# EAGLE design MSP_Mini_Voyger_V5 (EAGLE 7.3.0)
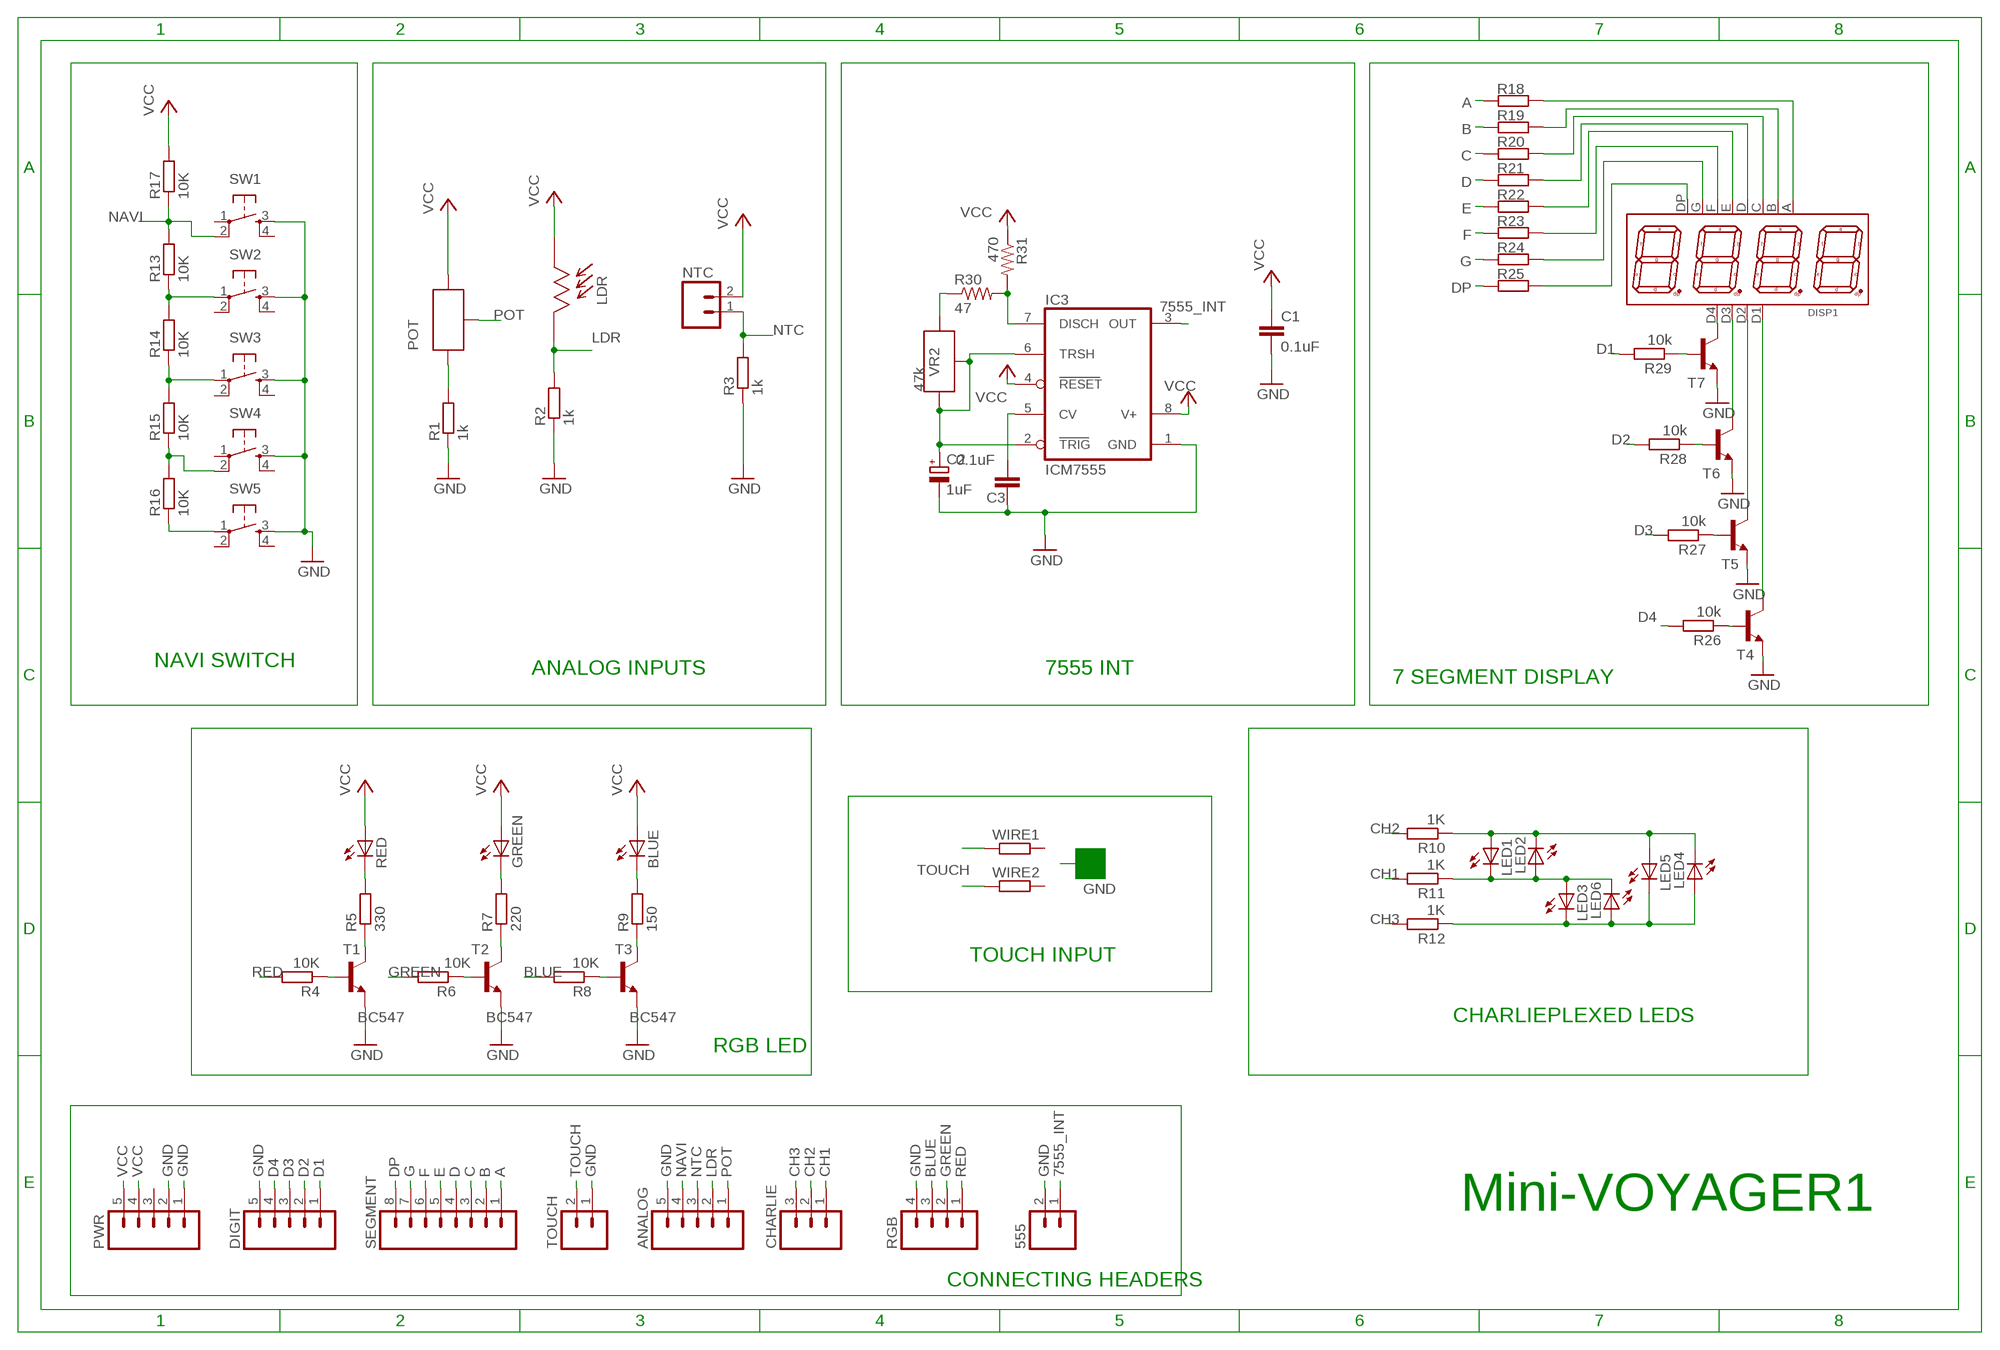
[diagram p0: schematic, sheet 1]

## Parts
555  M02  [02P]
ANALOG  M05  [05P]
BLUE  LED5MM  [LED5MM]
C1  0.1uF  C-EU050-024X044  [C050-024X044]
C2  1uF  CPOL-EUE2.5-7  [E2,5-7]
C3  0.1uF  C-EU025-024X044  [C025-024X044]
CHARLIE  M03  [03P]
DIGIT  M05  [05P]
DISP1  7-SEG_4D_0.36  [7SEG-4DIG]
GREEN  LED5MM  [LED5MM]
IC3  ICM7555  [DIL08]
LDR  CDSLDR3MM  [LDR3MM]
LED1  LED3MM  [LED3MM]
LED2  LED3MM  [LED3MM]
LED3  LED3MM  [LED3MM]
LED4  LED3MM  [LED3MM]
LED5  LED3MM  [LED3MM]
LED6  LED3MM  [LED3MM]
NTC  M02  [02P]
POT  POTNORMAL  [RJ9W]
PWR  M05  [05P]
R1  1k  R-EU_0207/10  [0207/10]
R2  1k  R-EU_0207/10  [0207/10]
R3  1k  R-EU_0207/10  [0207/10]
R4  10K  R-EU_0207/7  [0207/7]
R5  330  R-EU_0207/7  [0207/7]
R6  10K  R-EU_0207/7  [0207/7]
R7  220  R-EU_0207/7  [0207/7]
R8  10K  R-EU_0207/7  [0207/7]
R9  150  R-EU_0207/7  [0207/7]
R10  1K  R-EU_0207/10  [0207/10]
R11  1K  R-EU_0207/10  [0207/10]
R12  1K  R-EU_0207/10  [0207/10]
R13  10K  R-EU_0207/10  [0207/10]
R14  10K  R-EU_0207/10  [0207/10]
R15  10K  R-EU_0207/10  [0207/10]
R16  10K  R-EU_0207/10  [0207/10]
R17  10K  R-EU_0207/10  [0207/10]
R18  1k  R-EU_0207/7  [0207/7]
R19  1k  R-EU_0207/7  [0207/7]
R20  1k  R-EU_0207/7  [0207/7]
R21  1k  R-EU_0207/7  [0207/7]
R22  1k  R-EU_0207/7  [0207/7]
R23  1k  R-EU_0207/7  [0207/7]
R24  1k  R-EU_0207/7  [0207/7]
R25  1k  R-EU_0207/7  [0207/7]
R26  10k  R-EU_0207/7  [0207/7]
R27  10k  R-EU_0207/7  [0207/7]
R28  10k  R-EU_0207/7  [0207/7]
R29  10k  R-EU_0207/7  [0207/7]
R30  47  R-US_0207/7  [0207/7]
R31  470  R-US_0207/7  [0207/7]
RED  LED5MM  [LED5MM]
RGB  M04  [04P]
SEGMENT  M08  [08P]
SW1  OMRON_SWITCH_10-XX  [B3F-10XX]
SW2  OMRON_SWITCH_10-XX  [B3F-10XX]
SW3  OMRON_SWITCH_10-XX  [B3F-10XX]
SW4  OMRON_SWITCH_10-XX  [B3F-10XX]
SW5  OMRON_SWITCH_10-XX  [B3F-10XX]
T1  BC547  [TO92]
T2  BC547  [TO92]
T3  BC547  [TO92]
T4  BC547  [TO92]
T5  BC547  [TO92]
T6  BC547  [TO92]
T7  BC547  [TO92]
TOUCH  M02  [02P]
VR2  47k  POTNORMAL  [RJ9W]
WIRE1  R-EU_0207/15  [0207/15]
WIRE2  R-EU_0207/15  [0207/15]

## Nets
7555_INT: 555.1 IC3.3(OUT)
A: R18.2 SEGMENT.1
B: R19.2 SEGMENT.2
BLUE: R8.2 RGB.3
C: R20.2 SEGMENT.3
CH1: CHARLIE.1 R11.2
CH2: CHARLIE.2 R10.2
CH3: CHARLIE.3 R12.2
D: R21.2 SEGMENT.4
D1: DIGIT.1 R29.2
D2: DIGIT.2 R28.2
D3: DIGIT.3 R27.2
D4: DIGIT.4 R26.2
DP: R25.2 SEGMENT.8
E: R22.2 SEGMENT.5
F: R23.2 SEGMENT.6
G: R24.2 SEGMENT.7
GND: 555.2 ANALOG.5 C1.2 C2.- C3.2 DIGIT.5 IC3.1(GND) PWR.1 PWR.2 R1.1 R2.1 R3.1 RGB.4 SW1.3(S) SW2.3(S) SW3.3(S) SW4.3(S) SW5.3(S) T1.1(E) T2.1(E) T3.1(E) T4.1(E) T5.1(E) T6.1(E) T7.1(E) TOUCH.1
GREEN: R6.2 RGB.2
LDR: ANALOG.2 LDR.P$2 R2.2
N$1: POT.E R1.2
N$2: LED1.A LED2.K(C) LED4.K(C) LED5.A R10.1
N$3: IC3.7(DISCH) R30.2 R31.2
N$8: R5.1 T1.3(C)
N$10: DISP1.D1 T4.3(C)
N$11: DISP1.D4 T7.3(C)
N$12: DISP1.A R18.1
N$13: DISP1.B R19.1
N$14: R4.1 T1.2(B)
N$15: R13.1 R14.2 SW2.1(P)
N$16: R14.1 R15.2 SW3.1(P)
N$17: R15.1 R16.2 SW4.2(P1)
N$18: R16.1 SW5.1(P)
N$19: R6.1 T2.2(B)
N$20: DISP1.C R20.1
N$21: DISP1.D R21.1
N$23: R5.2 RED.K(C)
N$24: GREEN.K(C) R7.2
N$25: DISP1.E R22.1
N$26: R8.1 T3.2(B)
N$27: R9.1 T3.3(C)
N$28: BLUE.K(C) R9.2
N$30: R26.1 T4.2(B)
N$31: R27.1 T5.2(B)
N$32: R28.1 T6.2(B)
N$33: R29.1 T7.2(B)
N$34: DISP1.D2 T5.3(C)
N$35: DISP1.D3 T6.3(C)
N$36: DISP1.F R23.1
N$37: DISP1.G R24.1
N$38: DISP1.DP R25.1
N$44: C2.+ IC3.2(TRIG) IC3.6(TRSH) VR2.E VR2.S
N$51: R30.1 VR2.A
N$52: C3.1 IC3.5(CV)
N$323: LED3.K(C) LED4.A LED5.K(C) LED6.A R12.1
N$342: LED1.K(C) LED2.A LED3.A LED6.K(C) R11.1
NAVI: ANALOG.4 R13.2 R17.1 SW1.2(P1)
NTC: ANALOG.3 NTC.1 R3.2
POT: ANALOG.1 POT.S
R7: R7.1 T2.3(C)
RED: R4.2 RGB.1
TOUCH: TOUCH.2 WIRE1.1 WIRE2.1
VCC: BLUE.A C1.1 GREEN.A IC3.4(RESET) IC3.8(V+) LDR.P$1 NTC.2 POT.A PWR.4 PWR.5 R17.2 R31.1 RED.A
Unconnected: PWR.3 SW1.1(P) SW1.4(S1) SW2.2(P1) SW2.4(S1) SW3.2(P1) SW3.4(S1) SW4.1(P) SW4.4(S1) SW5.2(P1) SW5.4(S1) WIRE1.2 WIRE2.2

## Notes on the sheet
- NAVI SWITCH
- ANALOG INPUTS | 7555 INT
- 7 SEGMENT DISPLAY
- TOUCH INPUT
- CHARLIEPLEXED LEDS
- RGB LED
- Mini-VOYAGER1
- CONNECTING HEADERS

## Library data of the parts
555 = con-amp-quick:M02: AMP QUICK CONNECTOR; OC_FARNELL: unknown; OC_NEWARK: unknown
ANALOG DIGIT PWR = con-amp-quick:M05: AMP QUICK CONNECTOR; OC_FARNELL: unknown; OC_NEWARK: unknown
BLUE GREEN RED = CEDT_JANUARY_2015_v5:LED
C1 C3 = rcl:C-EU: CAPACITOR, European symbol
C2 = rcl:CPOL-EU: POLARIZED CAPACITOR, European symbol
CHARLIE = con-amp-quick:M03: AMP QUICK CONNECTOR; OC_FARNELL: unknown; OC_NEWARK: unknown
DISP1 = 7-seg_disp_0.36in:7-SEG_4D_0.36: 7-Segment 4-Digit Display 0.36" (9.11mm) Common Cathode. Created by David J. LEWIS (2015)
IC3 = maxim:ICM7555: TIMER; MF: MAXIM; MPN: ICM7555IPA+; OC_FARNELL: 9663762; OC_NEWARK: 68K4387
LDR = CEDT_JANUARY_2015_v7:CDSLDR3MM
LED1-LED6 = CEDT_JANUARY_2015_v7:LED
NTC TOUCH = CEDT_JANUARY_2015_v5:M02: AMP QUICK CONNECTOR
POT = CEDT_JANUARY_2015_v7:POT
R1-R29 WIRE1 WIRE2 = rcl:R-EU_: RESISTOR, European symbol
R30 R31 = rcl:R-US_: RESISTOR, American symbol
RGB = con-amp-quick:M04: AMP QUICK CONNECTOR; OC_FARNELL: unknown; OC_NEWARK: unknown
SEGMENT = con-amp-quick:M08: AMP QUICK CONNECTOR; OC_FARNELL: unknown; OC_NEWARK: unknown
SW1-SW5 = CEDT_JANUARY_2015_v7:OMRON_SWITCH
T1-T7 = transistor:BC547: NPN TRANSISTOR
VR2 = CEDT_JANUARY_2015_v4:POT

## Board
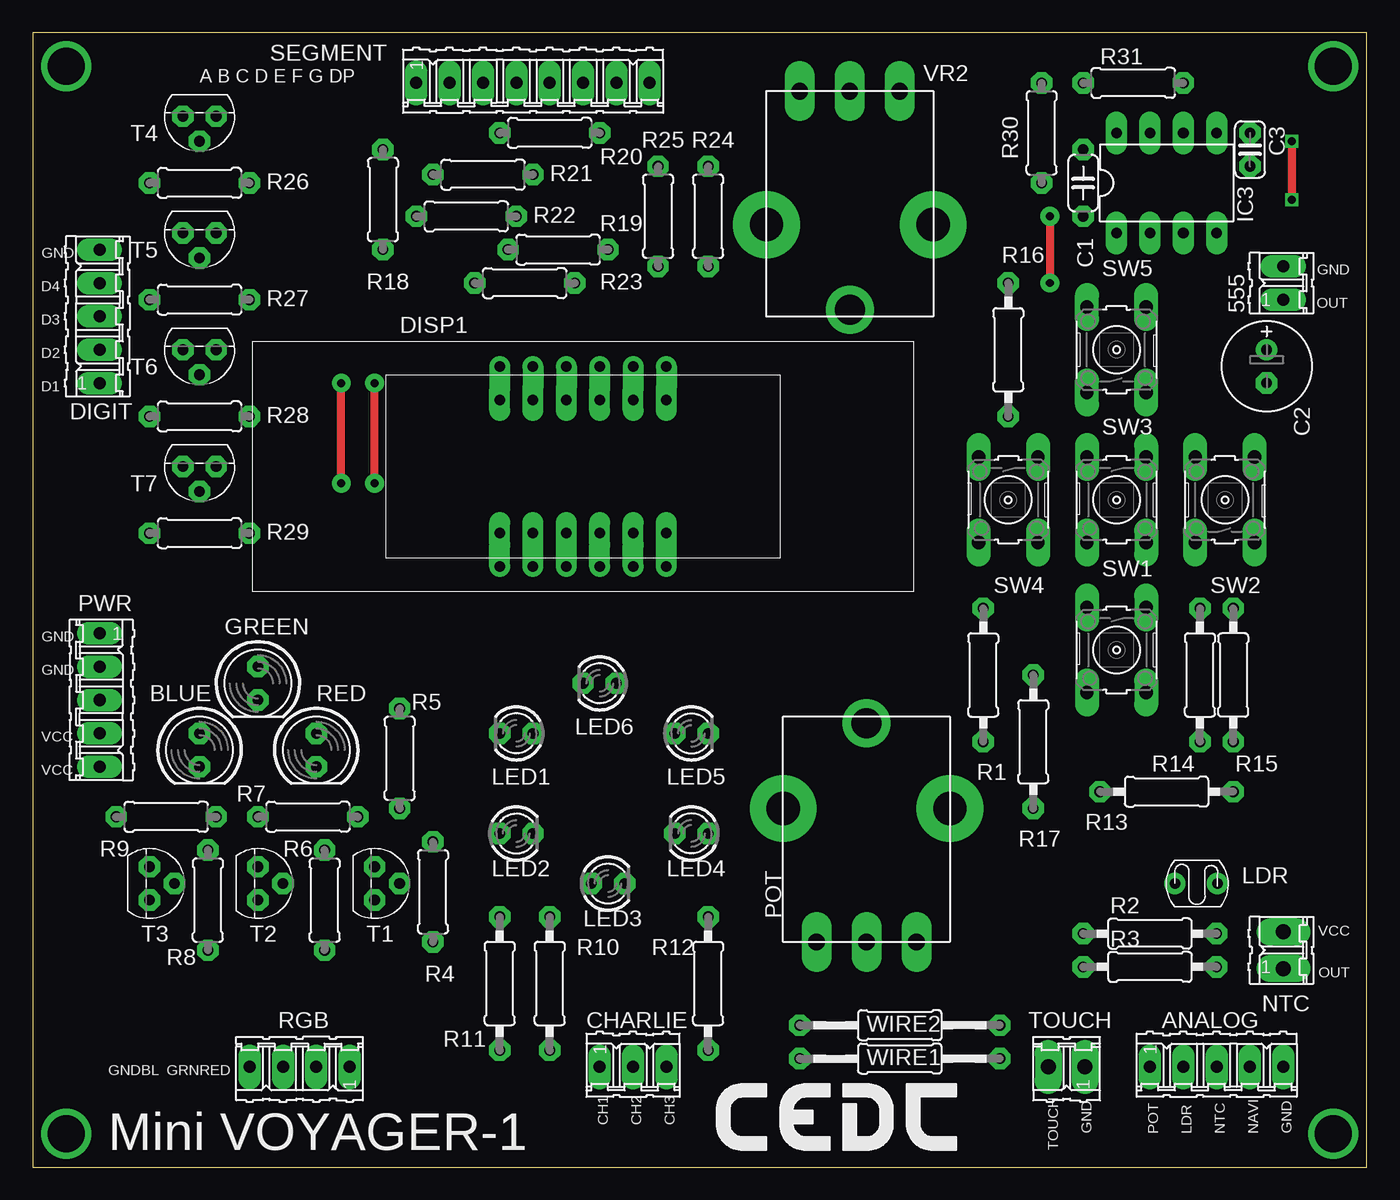
[diagram p1: board, top side]
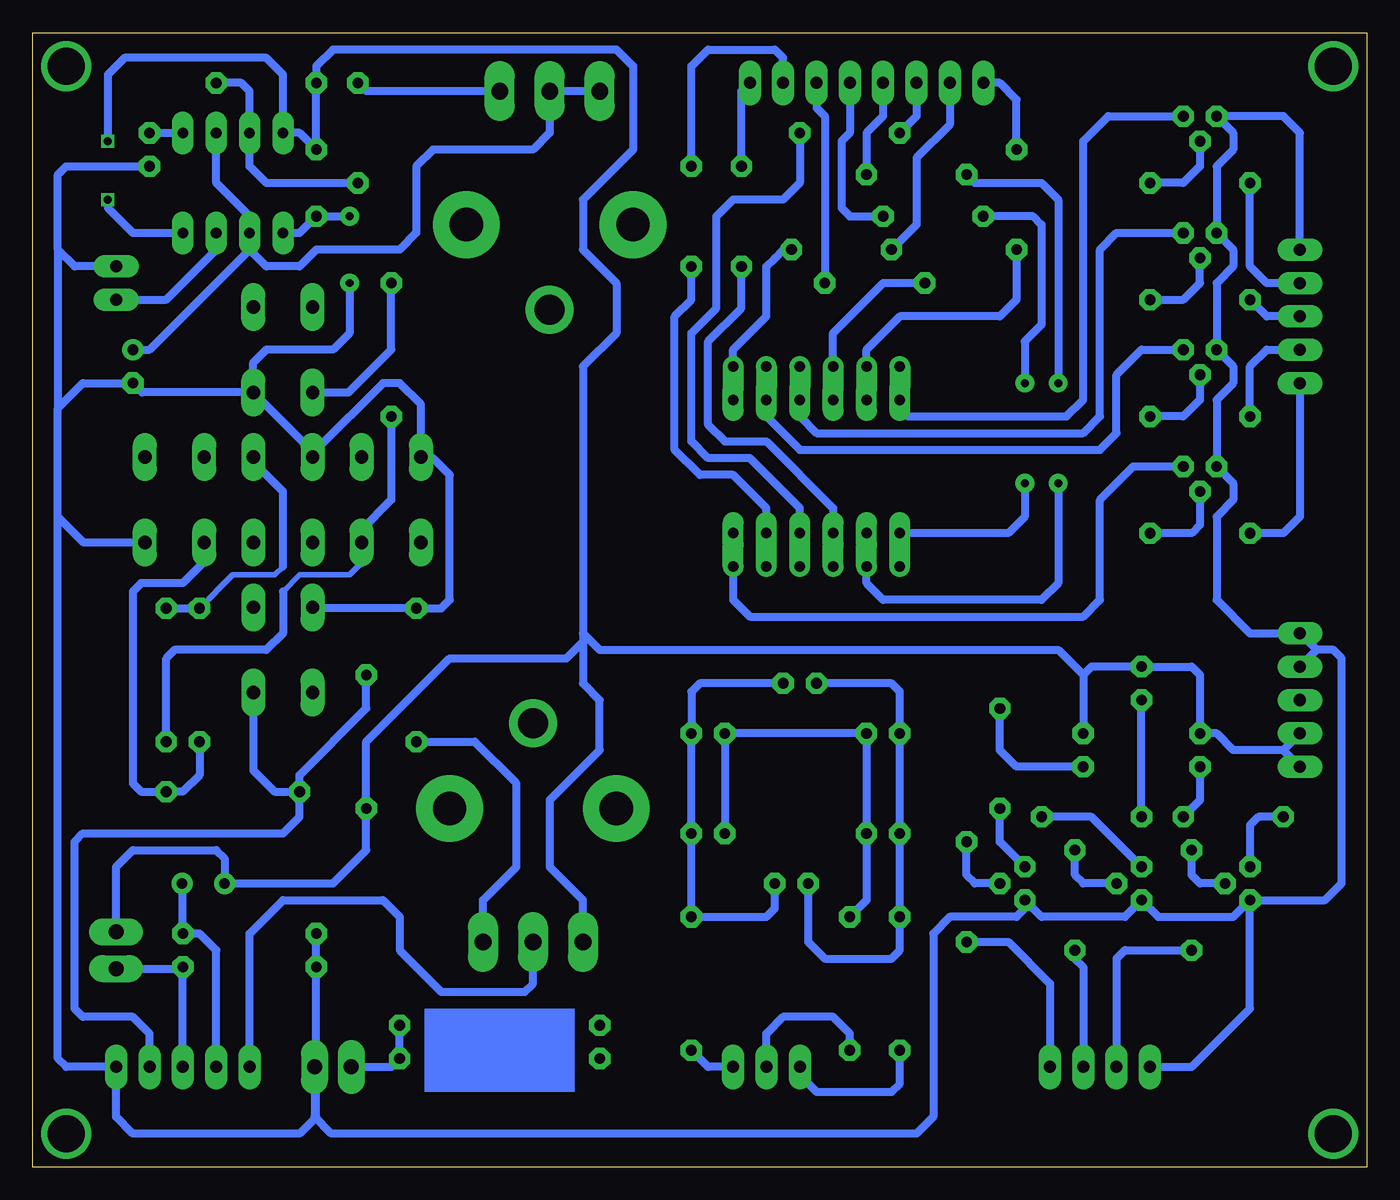
[diagram p2: board, bottom side, seen from below]

Size 101.6 x 86.36 mm. Coordinates in mm from the lower left corner, seen from the top.
Outline: 0,0 101.6,0 101.6,86.36 0,86.36 0,0
Copper layers (1*16): Top 0.035mm / dielectric 1.5mm / Bottom 0.035mm
Design rules "default *": minimum track width 16mil, minimum drill 24mil, track to track 16mil, track to pad 16mil, pad to pad 16mil, via to via 16mil, smd to smd 8mil, copper to edge 40mil, drill to drill 8mil, minimum pad ring 16mil, minimum via ring 8mil, stop-mask expansion 4mil, vias tented up to drill 0mil, thermal gap 10mil

### Footprints (pad centres in the part's own frame; a part is rotated, then mirrored left to right if it is on the bottom)
02P = drill 0.914 long: 1 -1.27,0; 2 1.27,0
05P = drill 0.914 long: 1 -5.08,0; 2 -2.54,0; 3 0,0; 4 2.54,0; 5 5.08,0
LED5MM = drill 0.813 octagon: A -1.27,0; K 1.27,0
C050-024X044 = drill 0.813 octagon: 1 -2.54,0; 2 2.54,0
E2,5-7 = drill 0.813 pad 1.6: + -1.27,0 | drill 0.813 pad 1.6 octagon: - 1.27,0
C025-024X044 = drill 0.813 octagon: 1 -1.27,0; 2 1.27,0
03P = drill 0.914 long: 1 -2.54,0; 2 0,0; 3 2.54,0
7SEG-4DIG = drill 0.8 long: A -3.81,5.08; B 6.35,5.08; C 1.27,-5.08; D -3.81,-5.08; D1 -6.35,5.08; D2 1.27,5.08; D3 3.81,5.08; D4 6.35,-5.08; DP -1.27,-5.08; E -6.35,-5.08; F -1.27,5.08; G 3.81,-5.08 | drill 0.8 offset: P$1 6.35,7.62; P$2 3.81,7.62; P$3 1.27,7.62; P$4 -1.27,7.62; P$5 -3.81,7.62; P$6 -6.35,7.62; P$7 -6.35,-7.62; P$8 -3.81,-7.62; P$9 -1.27,-7.62; P$10 1.27,-7.62; P$11 3.81,-7.62; P$12 6.35,-7.62
DIL08 = drill 0.813 long: 1 -3.81,-3.81; 2 -1.27,-3.81; 3 1.27,-3.81; 4 3.81,-3.81; 5 3.81,3.81; 6 1.27,3.81; 7 -1.27,3.81; 8 -3.81,3.81
LDR3MM = drill 0.8: P$1 0,0; P$2 3.24,0
LED3MM = drill 0.813 octagon: A -1.27,0; K 1.27,0
02P' = drill 1.143 long: 1 -1.397,0; 2 1.397,0
RJ9W = drill 1.27 long: A 3.81,8.255; E -3.81,8.255; S 0,8.255 | drill 2.286 pad 3.658: P$1 0,-8.382 | drill 2.54 pad 5.08: P$3 6.35,-1.905; P$4 -6.35,-1.905
0207/10 = drill 0.813 octagon: 1 -5.08,0; 2 5.08,0
0207/7 = drill 0.813 octagon: 1 -3.81,0; 2 3.81,0
04P = drill 0.914 long: 1 -3.81,0; 2 -1.27,0; 3 1.27,0; 4 3.81,0
08P = drill 0.914 long: 1 -8.89,0; 2 -6.35,0; 3 -3.81,0; 4 -1.27,0; 5 1.27,0; 6 3.81,0; 7 6.35,0; 8 8.89,0
B3F-10XX = drill 1.016 long: 1 -3.251,2.261; 2 3.251,2.261; 3 -3.251,-2.261; 4 3.251,-2.261
TO92 = drill 0.813 octagon: 1 1.27,0; 2 0,1.905; 3 -1.27,0
0207/15 = drill 0.813 octagon: 1 -7.62,0; 2 7.62,0

### Placement (x,y rotation side)
555  95.25,67.31 90 top
ANALOG  90.17,7.62 0 top
BLUE  12.7,31.75 270 top
C1  80.01,74.93 270 top
C2  93.98,60.96 270 top
C3  92.71,77.47 270 top
CHARLIE  45.72,7.62 0 top
DIGIT  5.08,64.77 90 top
DISP1  41.91,53.34 0 top
GREEN  17.14,36.83 270 top
IC3  86.36,74.93 0 top
LDR  87,21.59 0 top
LED1  36.83,33.02 180 top
LED2  36.83,25.4 0 top
LED3  43.81,21.59 0 top
LED4  50.16,25.4 180 top
LED5  50.16,33.02 0 top
LED6  43.18,36.83 180 top
NTC  [02P']  95.25,16.51 90 top
POT  63.5,25.4 180 top
PWR  5.08,35.56 270 top
R1  72.39,37.47 270 top
R2  85.09,17.78 0 top
R3  85.09,15.24 0 top
R4  30.48,20.95 270 top
R5  27.94,31.11 90 top
R6  22.23,20.32 270 top
R7  20.95,26.67 180 top
R8  13.34,20.32 270 top
R9  10.16,26.67 0 top
R10  39.37,13.97 270 top
R11  35.56,13.97 270 top
R12  51.44,13.97 270 top
R13  86.36,28.57 180 top
R14  88.9,37.47 270 top
R15  91.44,37.47 90 top
R16  74.3,62.23 270 top
R17  76.2,32.38 270 top
R18  26.67,73.66 90 top
R19  40.01,69.85 180 top
R20  39.37,78.74 180 top
R21  34.29,75.56 0 top
R22  33.02,72.39 0 top
R23  37.47,67.31 0 top
R24  51.44,72.39 90 top
R25  47.62,72.39 90 top
R26  12.7,74.93 180 top
R27  12.7,66.04 180 top
R28  12.7,57.15 180 top
R29  12.7,48.26 180 top
R30  76.83,78.74 270 top
R31  83.82,82.55 0 top
RED  21.59,31.75 270 top
RGB  20.32,7.62 180 top
SEGMENT  38.1,82.55 0 top
SW1  82.55,39.37 270 top
SW2  90.81,50.8 90 top
SW3  82.55,50.8 270 top
SW4  74.3,50.8 270 top
SW5  82.55,62.23 90 top
T1  26.04,21.59 270 top
T2  17.14,21.59 270 top
T3  8.89,21.59 270 top
T4  12.7,80.01 180 top
T5  12.7,71.12 180 top
T6  12.7,62.23 180 top
T7  12.7,53.34 180 top
TOUCH  [02P']  78.74,7.62 180 top
U$1  [LOGO-CEDT-SILK-18MM]  52.07,1.27 0 top
VR2  62.23,73.66 0 top
WIRE1  66.04,8.26 180 top
WIRE2  66.04,10.79 180 top

### Tracks (layer width: path | path; a pad name or v marks a point on that pad's centre or on a via)
7555_INT
  Bottom 0.61: IC3.3 87.63,69.85 91.44,66.04 555.1
A
  Bottom 0.61: R18.2 26.67,81.28 27.94,82.55 SEGMENT.1
B
  Bottom 0.61: SEGMENT.2 31.75,79.38 34.29,76.83 34.29,71.75 R19.2
BLUE
  Bottom 0.61: R8.2 18.41,16.51 19.05,15.88 RGB.3
C
  Bottom 0.61: SEGMENT.3 34.29,80.01 R20.2
CH1
  Bottom 0.61: R11.2 35.56,6.35 36.2,5.71 41.91,5.71 43.18,6.99 CHARLIE.1
CH2
  Bottom 0.61: CHARLIE.2 45.72,10.16 44.45,11.43 40.64,11.43 39.37,10.16 R10.2
CH3
  Bottom 0.61: R12.2 50.16,7.62 CHARLIE.3
D
  Bottom 0.61: SEGMENT.4 36.83,80.01 38.1,78.74 R21.2
D1
  Bottom 0.61: DIGIT.1 5.08,49.53 6.35,48.26 R29.2
D2
  Bottom 0.61: R28.2 8.89,60.96 7.62,62.23 DIGIT.2
D3
  Bottom 0.61: DIGIT.3 7.62,64.77 R27.2
D4
  Bottom 0.61: DIGIT.4 7.62,67.31 8.89,68.58 R26.2
DP
  Bottom 0.61: R25.2 47.62,81.92 SEGMENT.8
E
  Bottom 0.61: SEGMENT.5 39.37,78.74 40.01,78.11 40.01,73.03 39.37,72.39 R22.2
F
  Bottom 0.61: SEGMENT.6 41.91,80.64 41.27,80.01 R23.2
G
  Bottom 0.61: SEGMENT.7 44.45,84.45 45.09,85.09 50.16,85.09 51.44,83.82 R24.2
GND  (via drill 0.6 pad 1.42)
  Top 0.61: v77.47,72.39 v77.47,67.31
  Bottom 0.61: T3.1 10.16,19.05 15.88,19.05 T2.1 18.41,19.05 24.77,19.05 T1.1 26.04,19.68 26.67,19.05 31.75,19.05 33.02,17.78 33.02,3.81 34.29,2.54 78.87,2.54 80.14,3.81 | T3.1 8.89,12.06 13.34,7.62 RGB.4 | T3.1 3.17,20.32 1.91,21.59 1.91,38.73 2.54,39.37 3.81,39.37 | 3.81,39.37 PWR.1 8.89,40.64 11.43,43.18 11.43,49.53 10.16,50.8 10.16,52.07 T7.1 11.43,58.42 10.16,59.69 10.16,60.96 T6.1 11.43,67.31 10.16,68.58 10.16,69.85 T5.1 11.43,76.2 10.16,77.47 10.16,78.74 T4.1 6.35,80.01 5.08,78.74 DIGIT.5 | PWR.2 3.81,39.37 | 80.14,3.81 80.14,3.68 | 80.14,3.68 81.28,2.54 93.98,2.54 95.25,3.81 ANALOG.5 99.06,7.62 99.69,8.26 99.69,49.53 | SW1.3 79.73,42.55 R1.1 70.48,42.55 69.85,43.18 69.85,52.7 71.12,53.98 71.96,53.98 SW4.3 72.03,58.06 73.66,59.69 74.93,59.69 80.01,54.61 | TOUCH.1 80.14,3.81 | 80.14,3.68 80.01,3.81 R3.1 R2.1 | SW2.3 97.71,47.55 99.69,49.53 | 99.69,49.53 99.69,57.78 | 99.69,57.78 97.79,59.69 C2.- 93.27,58.98 SW5.3 | SW3.3 80.29,54.33 80.01,54.61 | 99.69,69.85 99.69,75.56 99.06,76.2 C3.2 | 99.69,69.85 98.42,68.58 555.2 | 99.69,69.85 99.69,57.78 | IC3.1 81.28,71.12 C1.2 v77.47,72.39 | v77.47,67.31 77.47,63.5 78.74,62.23 83.82,62.23 84.81,61.24 SW5.3 | 80.01,54.61 80.44,54.61 SW5.3
GREEN
  Bottom 0.61: R6.2 22.23,15.88 21.59,15.24 RGB.2
LDR
  Bottom 0.61: ANALOG.2 87.63,16.51 88.9,17.78 R2.2 90.23,17.84 LDR.P$2
N$1
  Bottom 0.61: POT.E 67.31,20.32 64.77,22.86 64.77,29.21 67.94,32.38 R1.2
N$2
  Bottom 0.61: LED4.K LED5.A LED1.A LED2.K 38.1,20.32 R10.1
N$3
  Bottom 0.61: R30.2 83.82,74.93 85.09,76.2 IC3.7 85.09,81.92 85.72,82.55 R31.2
N$5  (via drill 2.8 pad 3.81)
  other vias: 2.54,83.82
N$6  (via drill 2.8 pad 3.81)
  other vias: 99.06,83.82
N$7  (via drill 2.8 pad 3.81)
  other vias: 2.54,2.54
N$8
  Bottom 0.61: T1.3 27.94,24.77 R5.1
N$9  (via drill 2.8 pad 3.81)
  other vias: 99.06,2.54
N$10
  Bottom 0.61: DISP1.D1 35.56,57.78 34.92,57.15 22.86,57.15 21.59,58.42 21.59,78.11 19.68,80.01 T4.3
N$11
  Bottom 0.61: DISP1.D4 48.26,43.18 46.99,41.91 21.59,41.91 20.32,43.18 20.32,50.8 17.78,53.34 T7.3
N$12
  Bottom 0.61: R18.1 26.67,66.04 27.94,64.77 35.56,64.77 38.1,62.23 DISP1.A
N$13
  Bottom 0.61: R19.1 44.45,69.85 45.09,69.22 45.72,68.58 45.72,64.77 48.26,62.23 DISP1.B
N$14
  Bottom 0.61: T1.2 29.84,21.59 30.48,22.23 R4.1
N$15
  Bottom 0.61: R14.2 88.9,29.84 90.17,28.57 R13.1 93.34,28.57 93.98,29.21 93.98,43.81 93.34,44.45 90.17,44.45 88.54,46.08 SW2.1
N$16
  Bottom 0.406: R14.1 86.36,45.09 83.19,45.09 82.55,45.72
  Bottom 0.61: R15.2 R14.1 | SW3.1 84.81,53.7 82.55,51.44 82.55,45.72
N$17
  Bottom 0.406: 76.56,46 77.47,45.09 81.28,45.09 82.55,43.81
  Bottom 0.61: R16.2 74.3,50.8 76.56,48.54 SW4.2 76.56,46 | R15.1 91.44,38.73 90.81,39.37 83.82,39.37 82.55,40.64 82.55,43.81
N$18
  Bottom 0.61: R16.1 74.3,62.23 77.55,58.98 SW5.1
N$19
  Bottom 0.61: T2.2 21.59,21.59 22.23,22.23 R6.1
N$20
  Bottom 0.61: R20.1 43.18,74.93 44.45,73.66 48.26,73.66 49.53,72.39 49.53,65.41 51.44,63.5 51.44,55.24 50.16,53.98 46.99,53.98 43.18,50.16 DISP1.C
N$21  (via drill 0.6 pad 1.42)
  Top 0.61: v23.5,52.07 v23.5,59.69
  Bottom 0.61: R21.1 29.84,74.93 24.77,74.93 23.5,73.66 v23.5,59.69 | DISP1.D 38.1,44.45 36.83,43.18 24.77,43.18 23.5,44.45 v23.5,52.07
N$23
  Bottom 0.61: RED.K 26.67,30.48 27.94,31.75 R5.2
N$24
  Bottom 0.61: R7.2 GREEN.K
N$25  (via drill 0.6 pad 1.42)
  Top 0.61: v26.04,52.07 v26.04,59.69
  Bottom 0.61: R22.1 25.4,72.39 24.77,71.75 24.77,64.14 26.04,62.87 v26.04,59.69 | v26.04,52.07 26.04,49.53 27.3,48.26 DISP1.E
N$26
  Bottom 0.61: T3.2 12.7,21.59 13.34,22.23 R8.1
N$27
  Bottom 0.61: R9.1 8.26,26.67 8.89,26.04 T3.3
N$28
  Bottom 0.61: BLUE.K 12.7,27.94 R9.2
N$30
  Bottom 0.61: T4.2 12.7,76.2 13.97,74.93 R26.1
N$31
  Bottom 0.61: R27.1 13.97,66.04 12.7,67.31 T5.2
N$32
  Bottom 0.61: T6.2 12.7,58.42 13.97,57.15 R28.1
N$33
  Bottom 0.61: T7.2 12.7,48.9 13.34,48.26 R29.1
N$34
  Bottom 0.61: DISP1.D2 43.18,57.15 41.91,55.88 21.59,55.88 20.32,57.15 20.32,69.85 19.05,71.12 T5.3
N$35
  Bottom 0.61: DISP1.D3 45.72,57.15 43.18,54.61 20.32,54.61 19.05,55.88 19.05,60.33 17.14,62.23 T6.3
N$36
  Bottom 0.61: R23.1 36.83,67.31 40.64,63.5 DISP1.F
N$37
  Bottom 0.61: R24.1 51.44,66.04 52.7,64.77 52.7,54.61 50.8,52.7 48.26,52.7 45.72,50.16 DISP1.G
N$38
  Bottom 0.61: DISP1.DP 40.64,50.16 45.72,55.24 48.9,55.24 50.16,56.52 50.16,62.87 47.62,65.41 R25.1
N$44
  Bottom 0.61: IC3.6 87.63,74.93 85.09,72.39 IC3.2 85.09,69.85 | C2.+ 92.71,62.23 85.09,69.85 | VR2.E VR2.S 62.23,78.74 63.5,77.47 71.12,77.47 72.39,76.2 72.39,71.12 73.66,69.85 80.01,69.85 81.28,68.58 83.82,68.58 85.09,69.85
N$51
  Bottom 0.61: VR2.A 76.2,81.92 R30.1
N$52
  Bottom 0.61: C3.1 IC3.5
N$323
  Bottom 0.61: LED6.A 50.8,36.83 51.44,36.2 LED5.K LED4.A R12.1 45.72,19.05 45.09,19.68 LED3.K
N$342
  Bottom 0.61: LED6.K 36.2,36.83 35.56,36.2 LED1.K LED2.A R11.1 35.56,16.51 36.2,15.88 41.27,15.88 42.55,17.14 LED3.A
NAVI
  Bottom 0.61: R13.2 81.28,29.84 76.2,34.92 R17.1 | ANALOG.4 92.71,10.16 93.98,11.43 97.79,11.43 98.42,12.06 98.42,24.77 97.79,25.4 96.52,25.4 94.61,25.4 82.55,25.4 81.28,26.67 R13.2 | SW1.2 84.81,30.2 83.19,28.57 R13.2
NTC
  Bottom 0.61: ANALOG.3 R3.2 90.3,15.11 NTC.1
POT
  Bottom 0.61: ANALOG.1 85.09,17.78 82.55,20.32 74.93,20.32 73.66,19.05 73.66,16.51 70.48,13.34 64.14,13.34 63.5,13.97 POT.S
R7
  Bottom 0.61: T2.3 20.95,26.67 R7.1
RED
  Bottom 0.61: R4.2 27.3,17.14 24.13,13.97 RGB.1
TOUCH
  Bottom 0.61: TOUCH.2 74.3,7.62 WIRE1.1 WIRE2.1
VCC  (via drill 0.6)
  Top 0.61: v95.89,78.11 v95.89,73.66
  Bottom 0.61: 21.59,37.47 20.95,38.1 GREEN.A 13.34,38.1 12.7,37.47 BLUE.A 11.43,33.02 10.16,31.75 6.35,31.75 | 21.59,37.47 RED.A | PWR.4 6.35,31.75 | PWR.5 6.35,31.75 | 21.59,37.47 23.5,39.37 58.42,39.37 59.69,40.64 | 59.69,40.64 59.69,40.01 | 59.69,40.01 59.69,36.83 58.42,35.56 58.42,31.75 62.23,27.94 62.23,22.86 59.69,20.32 POT.A | NTC.2 95.25,22.86 93.98,24.13 87.63,24.13 87,23.5 LDR.P$1 78.74,21.59 76.2,24.13 R17.2 76.2,32.38 69.85,38.73 60.96,38.73 59.69,40.01 | 59.69,40.64 59.69,60.96 57.15,63.5 57.15,67.31 59.69,69.85 59.69,73.66 55.88,77.47 55.88,83.82 57.15,85.09 78.74,85.09 80.01,83.82 R31.1 C1.1 81.28,78.74 IC3.8 82.55,83.19 83.82,84.45 94.61,84.45 95.89,83.19 v95.89,78.11 | v95.89,73.66 95.89,73.03 93.98,71.12 IC3.4
(copper drawn outside any net)
  shapes: Bottom area x1

### Text on the board
tPlace: A B C D E F G DP | GND | GND | D4 | OUT | D3 | D2 | D1 | GND | GND | VCC | VCC | VCC | OUT | GND | BL | GRN | RED | CH1 | CH2 | CH3 | GND | POT | LDR | NTC | NAVI | GND | Mini VOYAGER-1 | TOUCH